# Altium schematic sheet RasPi_Hat_Temp.SchDoc
size A4
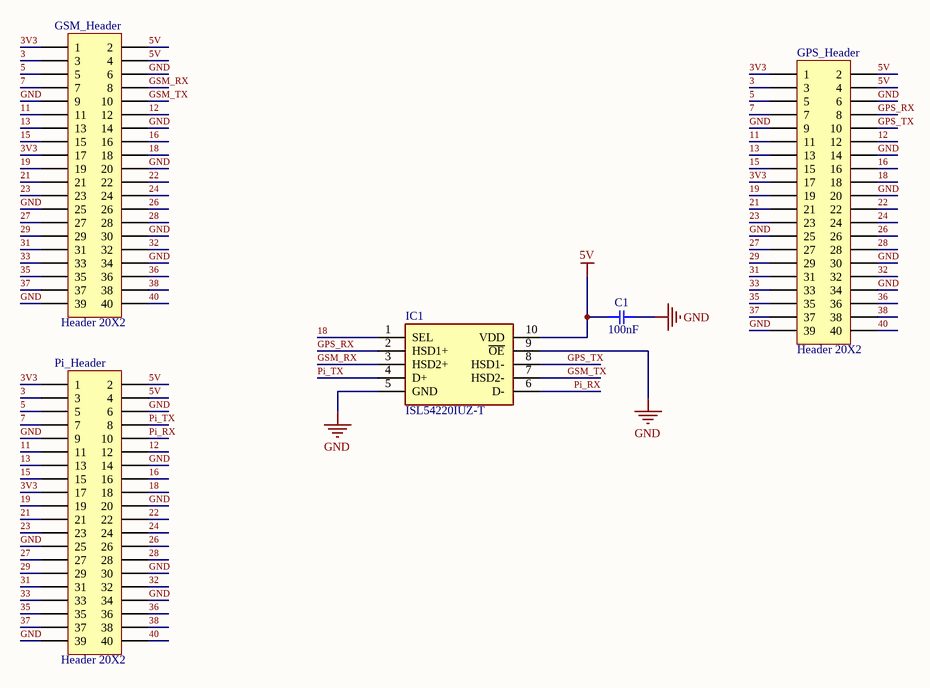
[diagram p0: RasPi_Hat_Temp.SchDoc]

## Parts
C1  100nF  [SMD-0402C]
GPS_Header  Header 20X2  [HDR2X20]
GSM_Header  Header 20X2  [HDR2X20]
IC1  ISL54220IUZ-T  [SOP50P490X110-10N]
Pi_Header  Header 20X2  [HDR2X20]

## Nets
5V: C1.1 GPS_Header.2 GPS_Header.4 GSM_Header.2 GSM_Header.4 IC1.10(VDD) Pi_Header.2 Pi_Header.4
GND: C1.2 GPS_Header.6 GPS_Header.9 GPS_Header.14 GPS_Header.20 GPS_Header.25 GPS_Header.30 GPS_Header.34 GPS_Header.39 GSM_Header.6 GSM_Header.9 GSM_Header.14 GSM_Header.20 GSM_Header.25 GSM_Header.30 GSM_Header.34 GSM_Header.39 IC1.5(GND) IC1.9(~{OE}) Pi_Header.6 Pi_Header.9 Pi_Header.14 Pi_Header.20 Pi_Header.25 Pi_Header.30 Pi_Header.34 Pi_Header.39
3: GPS_Header.3 GSM_Header.3 Pi_Header.3
3V3: GPS_Header.1 GPS_Header.17 GSM_Header.1 GSM_Header.17 Pi_Header.1 Pi_Header.17
5: GPS_Header.5 GSM_Header.5 Pi_Header.5
7: GPS_Header.7 GSM_Header.7 Pi_Header.7
11: GPS_Header.11 GSM_Header.11 Pi_Header.11
12: GPS_Header.12 GSM_Header.12 Pi_Header.12
13: GPS_Header.13 GSM_Header.13 Pi_Header.13
15: GPS_Header.15 GSM_Header.15 Pi_Header.15
16: GPS_Header.16 GSM_Header.16 Pi_Header.16
18: GPS_Header.18 GSM_Header.18 IC1.1(SEL) Pi_Header.18
19: GPS_Header.19 GSM_Header.19 Pi_Header.19
21: GPS_Header.21 GSM_Header.21 Pi_Header.21
22: GPS_Header.22 GSM_Header.22 Pi_Header.22
23: GPS_Header.23 GSM_Header.23 Pi_Header.23
24: GPS_Header.24 GSM_Header.24 Pi_Header.24
26: GPS_Header.26 GSM_Header.26 Pi_Header.26
27: GPS_Header.27 GSM_Header.27 Pi_Header.27
28: GPS_Header.28 GSM_Header.28 Pi_Header.28
29: GPS_Header.29 GSM_Header.29 Pi_Header.29
31: GPS_Header.31 GSM_Header.31 Pi_Header.31
32: GPS_Header.32 GSM_Header.32 Pi_Header.32
33: GPS_Header.33 GSM_Header.33 Pi_Header.33
35: GPS_Header.35 GSM_Header.35 Pi_Header.35
36: GPS_Header.36 GSM_Header.36 Pi_Header.36
37: GPS_Header.37 GSM_Header.37 Pi_Header.37
38: GPS_Header.38 GSM_Header.38 Pi_Header.38
40: GPS_Header.40 GSM_Header.40 Pi_Header.40
GPS_RX: GPS_Header.8 IC1.2(HSD1+)
GPS_TX: GPS_Header.10 IC1.8(HSD1-)
GSM_RX: GSM_Header.8 IC1.3(HSD2+)
GSM_TX: GSM_Header.10 IC1.7(HSD2-)
Pi_RX: IC1.6(D-) Pi_Header.10
Pi_TX: IC1.4(D+) Pi_Header.8

## Library data of the parts
C1 = GCM155C71A105KE38D: CAP CER 1UF 10V X7S 0402; Manufacturer: Murata Electronics North America; Factory Stock: 0; Unit Price (USD): 0.12; Minimum Quantity: 1; Tolerance: ±10%; Datasheets: http://www.murata.com/~/media/webrenewal/support/library/catalog/products/capacitor/mlcc/c03e.ashx; Image: //media.digikey.com/Renders/Murata%20Renders/ZRB-SERIES-0402.jpg; Digi-Key Part Number: 490-13409-1-ND; Part Number: GCM155C71A105KE38D; Quantity Available: 7240; @ qty: 0; Packaging: Cut Tape (CT); Series: GCM; Part Status: Active; Value: 100nF; Voltage: 10V; Temperature Coefficient: X7S; Operating Temperature: -55°C ~ 125°C; Features: -; Ratings: AEC-Q200; Applications: Automotive; Mounting Type: Surface Mount, MLCC; Package / Case: 0402 (1005 Metric); Size / Dimension: 0.039" L x 0.020" W (1.00mm x 0.50mm); Height - Seated (Max): -; Thickness (Max): 0.022" (0.55mm); Lead Spacing: -; Lead Style: -
GPS_Header GSM_Header Pi_Header = Header 20X2: Header, 20-Pin, Dual row; LatestRevisionDate: 17-Jul-2002; LatestRevisionNote: Re-released for DXP Platform.; Publisher: Altium Limited
IC1 = ISL54220IUZ-T: Integrated Circuit; Manufacturer_Name: Renesas / Intersil; Datasheet Link: https://www.renesas.com/kr/en/www/doc/datasheet/isl54220.pdf; Height: 1.1mm; Manufacturer_Part_Number: ISL54220IUZ-T; Mouser Part Number: 968-ISL54220IUZ-T; Mouser Price/Stock: https://www.mouser.com/Search/Refine.aspx?Keyword=968-ISL54220IUZ-T